# Altium project altium-git-test.PrjPcb
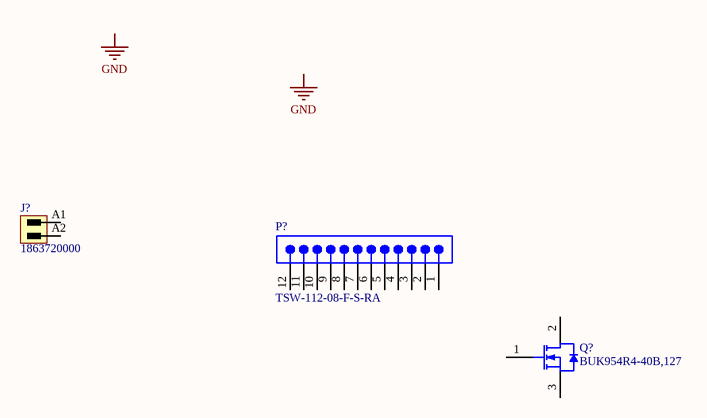
[diagram p0: Sheet1.SchDoc]
1 sheet, 3 parts. Net scope: global (net labels, ports and power ports of the same name join across sheets).
Board file: PCB2.PcbDoc

## Sheet Sheet1.SchDoc
size A; SheetNumber: 1; SheetTotal: 1

### Parts
J?  1863720000  [SC_SMT_3_81_180G_02]
P?  TSW-112-08-F-S-RA  [SMTC-TSW-112-08-X-S-RA]
Q?  BUK954R4-40B,127  [NXP-SOT78A]

### Nets

Not connected (* = marked no-connect by the designer): J? A1 A2; P? 1 2 3 4 5 6 7 8 9 10 11 12; Q? 1(G) 2(D) 3(S)

### Notes on the sheet
- Labels drawn without touching a wire or pin: GND

### Library data of the parts
J? = CMP-1559-00412-1: OMNIMATE Signal - series BC/SC 3.81; Manufacturer: Weidmueller; UL_94_flammability_rating: V-0; Rated_voltage_use_group_B_UL_1059: 300 V; Pitch_mm: 3.81 mm; Mounting_onto_the_PCB: Reflow solder connection; Insulating_material: LCP GF; Rated_voltage_for_surge_voltage_class_pollution_degree_II_2: 320 V; No_of_poles: 2; Outgoing_elbow: 180°; Rated_current_use_group_B_UL_1059: 10 A; Side_termination_characteristic: closed side; Pitch_inch: 0.15 inch; Solder_pin_length_mm: 1.5 mm; Short_text_for_material: SC-SMT 3.81/02/180G 1.5SN BK BX; Contact_surface: tinned; Rated_current_min_no_of_poles_TU_20_deg_C: 17.5 A; PackageReference: SC_SMT_3_81_180G_02; Revision: V1; ComponentLink2Description: URL Link1; Colour: Black; ComponentLink1Description: Manufacturer URL; Packaging: Box; PartNumber: 1863720000; Qty: 50 PCS; ComponentLink1URL: http://www.weidmueller.com/; ComponentLink2URL: http://catalog.weidmueller.com/catalog/Start.do?localeId=en&ObjectID=1863720000
P? = CMP-1024-00428-1: 0.025" SQ Post Header, Through-hole, Right Angle, -55 to 125 degC, 2.54 mm Pitch, 12-Pin, Male, RoHS; Manufacturer: Samtec; Pitch: 2.54 mm; ComponentLink2URL: http://www.samtec.com/documents/webfiles/pdf/TSW_TH.PDF; ComponentLink2Description: Datasheet; PartNumber: TSW-112-08-F-S-RA; ComponentLink3Description: Package Specification; DatasheetVersion: F-214; PackageReference: TSW-112-08-X-S-RA; PackageVersion: DM, 8/1988; Temperature Range: -55 to 125 degC; Mounting Technology: Through-hole; ComponentLink1Description: Manufacturer URL; RoHS: True; Orientation: Right Angle; ComponentLink1URL: http://www.samtec.com; ComponentLink3URL: http://www.samtec.com/documents/webfiles/cpdf/TSW-XXX-XX-XXX-X-XX-XXX-MKT.pdf; PackageDescription: .025[0.64] SQ. Post Terminal Strip Assembly
Q? = CMP-1259-00499-1: N-Channel TrenchMOS Logic Level FET, 40 V, 3-Pin SOT78A, Rail; Manufacturer: NXP Semiconductors; IDM [max] (A): 697; VDS [max] (V): 40; Channel Type: N; Qr [typ] (nC): 67; VGSth [typ] (V): 1.5; Automotive Qualified: Y; Packing: Rail; Code_JEDEC: 3-lead TO-220AB; Mounting Technology: Through Hole; ComponentLink2Description: Datasheet; DatasheetVersion: Rev. 03; PackageDescription: 3-Pin Flange Mount, Vertical Straight Lead, Body 10 x 4.3 mm, Pitch 2.54 mm; PackageVersion: 05-03-14, 03/2005; ComponentLink1Description: Manufacturer URL; ComponentLink2URL: http://www.nxp.com/documents/data_sheet/BUK954R4-40B.pdf; ComponentLink1URL: http://www.nxp.com/; Code_JEITA: SC-46; PartNumber: BUK954R4-40B,127; PackageReference: SOT78A; ComponentLink3URL: http://www.nxp.com/documents/outline_drawing/sot078a_po.pdf; ComponentLink3Description: Package Specification

## Assembly variants
test-variant: not fitted P?; alternate parts Q? -> CMP-013-00020-4